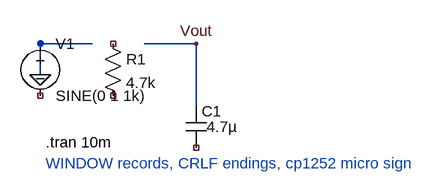
[diagram p0: schematic windowed_rc.asc]
windowed_rc.asc, the LTspice schematic file:
Version 4
SHEET 1 880 680
WIRE 144 112 64 112
WIRE 304 112 224 112
WIRE 64 160 64 112
WIRE 304 208 304 112
FLAG 64 160 0
FLAG 304 112 Vout
SYMBOL voltage 64 96 R0
WINDOW 123 0 0 Left 0
WINDOW 39 0 0 Left 0
SYMATTR InstName V1
SYMATTR Value SINE(0 1 1k)
SYMBOL res 160 96 R0
WINDOW 0 36 40 Left 2
WINDOW 3 36 76 Left 2
SYMATTR InstName R1
SYMATTR Value 4.7k
SYMBOL cap 288 208 R0
WINDOW 3 32 32 Left 2
SYMATTR InstName C1
SYMATTR Value 4.7µ
TEXT 72 264 Left 2 !.tran 10m
TEXT 72 296 Left 2 ;WINDOW records, CRLF endings, cp1252 micro sign

The netlist it stands for:
* windowed_rc.asc
V1 0 NC_01 SINE(0 1 1k)
R1 NC_02 NC_03 4.7k
C1 Vout NC_04 4.7µ
.tran 10m
* WINDOW records, CRLF endings, cp1252 micro sign
.backanno
.end